# EAGLE schematic lcd_brd (EAGLE 6.2)
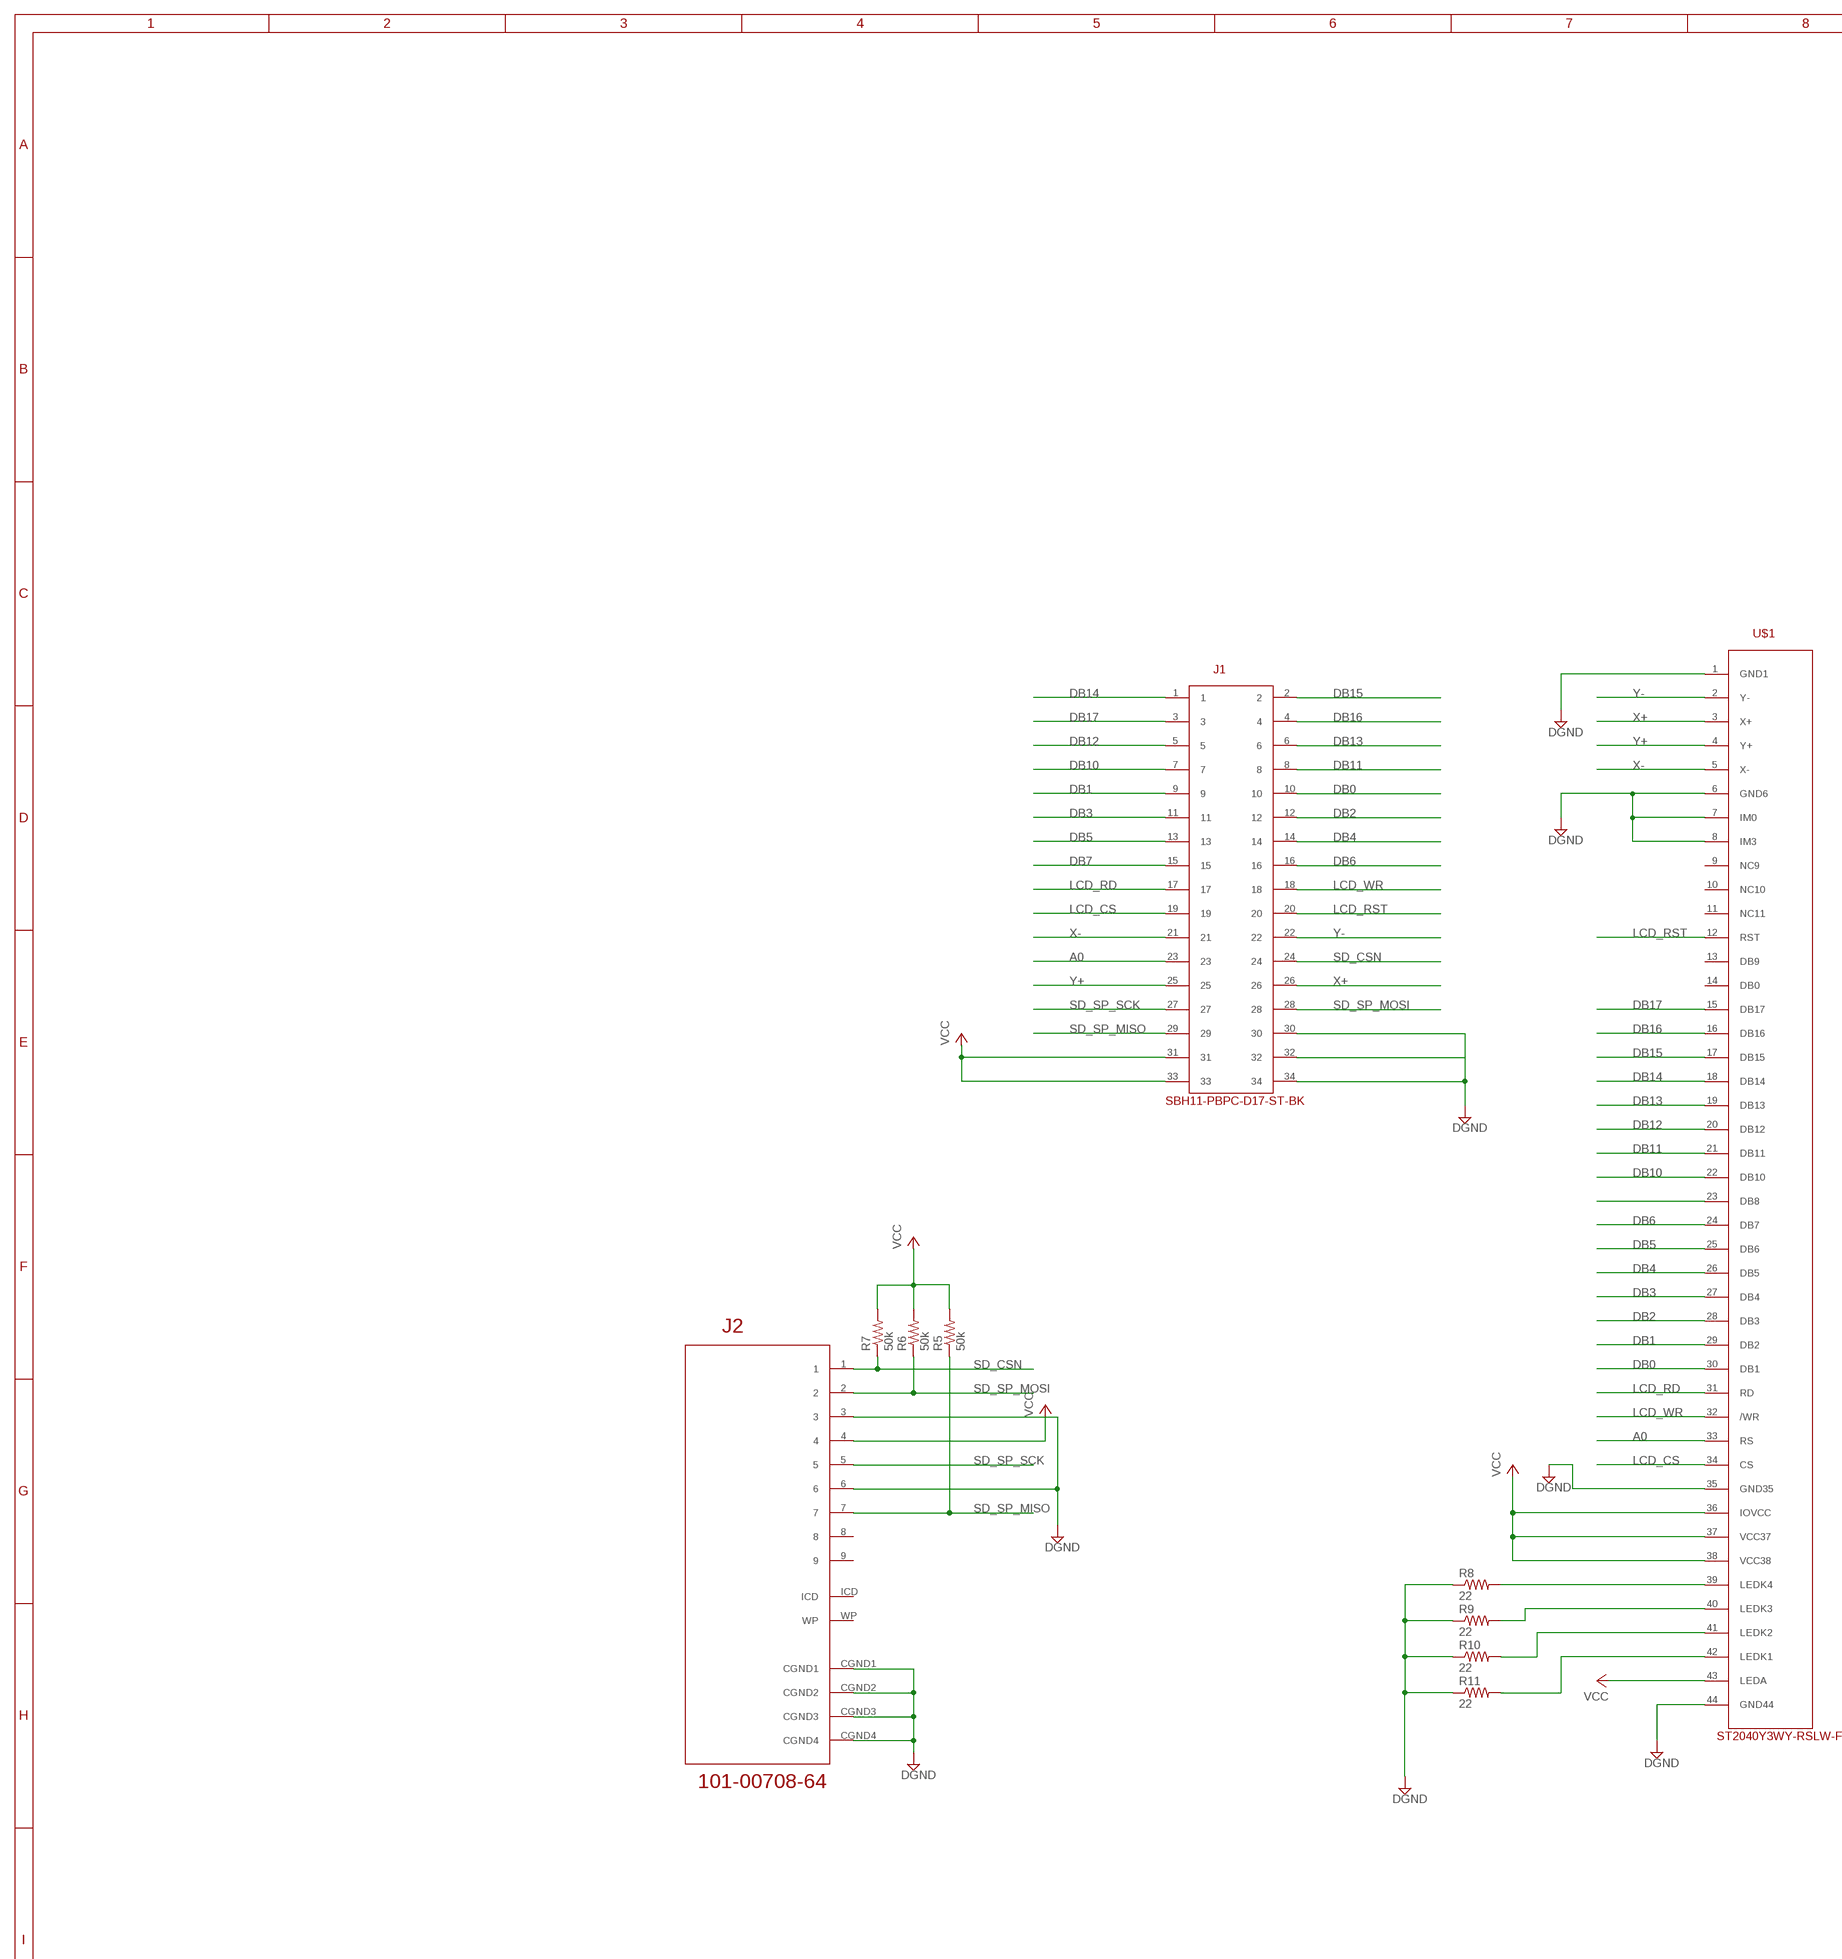
[diagram p0: schematic, sheet 1, part 1 of 2]
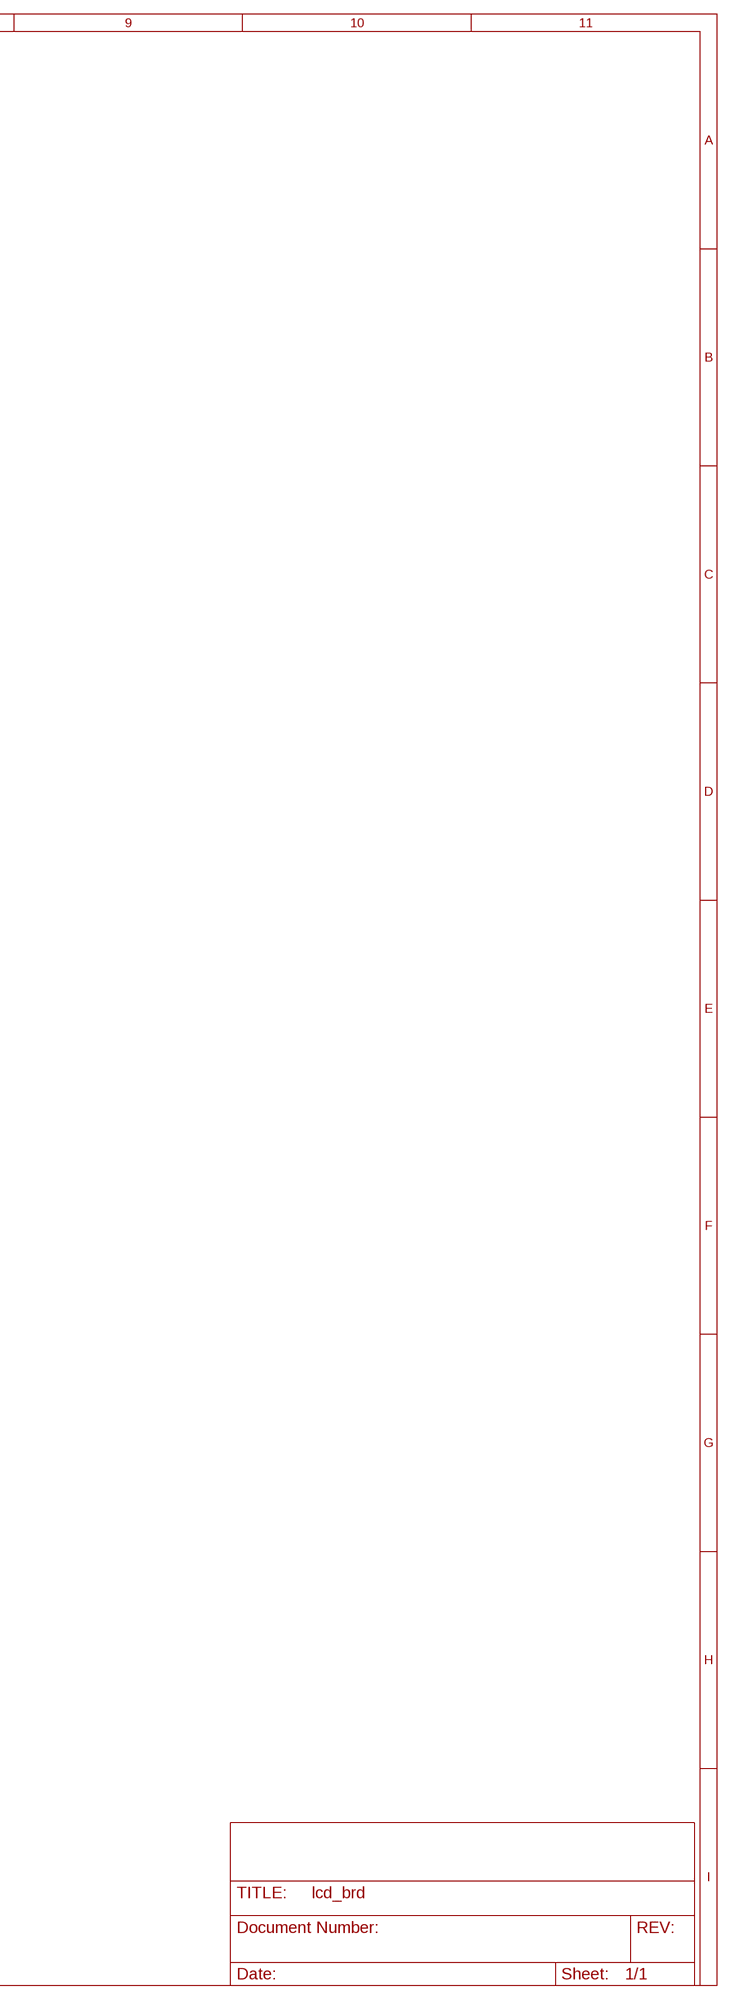
[diagram p1: schematic, sheet 1, part 2 of 2]

## Parts
J1  SBH11-PBPC-D17-ST-BK  [SBH11-PBPC-D17-ST-BK]
J2  101-00708-64  [101-00708-64]
R5  50k  R-US_R0603  [R0603]
R6  50k  R-US_R0603  [R0603]
R7  50k  R-US_R0603  [R0603]
R8  22  R-US_R0603  [R0603]
R9  22  R-US_R0603  [R0603]
R10  22  R-US_R0603  [R0603]
R11  22  R-US_R0603  [R0603]
U$1  ST2040Y3WY-RSLW-F  [ST0240Y3WY-RSLW-F]

## Nets
A0: J1.23 U$1.33(RS)
DB0: J1.10 U$1.30(DB1)
DB1: J1.9 U$1.29(DB2)
DB2: J1.12 U$1.28(DB3)
DB3: J1.11 U$1.27(DB4)
DB4: J1.14 U$1.26(DB5)
DB5: J1.13 U$1.25(DB6)
DB6: J1.16 U$1.24(DB7)
DB7: J1.15 U$1.23(DB8)
DB10: J1.7 U$1.22(DB10)
DB11: J1.8 U$1.21(DB11)
DB12: J1.5 U$1.20(DB12)
DB13: J1.6 U$1.19(DB13)
DB14: J1.1 U$1.18(DB14)
DB15: J1.2 U$1.17(DB15)
DB16: J1.4 U$1.16(DB16)
DB17: J1.3 U$1.15(DB17)
DGND: J1.30 J1.32 J1.34 J2.3 J2.6 J2.CGND1 J2.CGND2 J2.CGND3 J2.CGND4 R8.1 R9.1 R10.1 R11.1 U$1.1(GND1) U$1.6(GND6) U$1.7(IM0) U$1.8(IM3) U$1.35(GND35) U$1.44(GND44)
LCD_CS: J1.19 U$1.34(CS)
LCD_RD: J1.17 U$1.31(RD)
LCD_RST: J1.20 U$1.12(RST)
LCD_WR: J1.18 U$1.32(/WR)
N$12: R8.2 U$1.39(LEDK4)
N$13: R9.2 U$1.40(LEDK3)
N$14: R10.2 U$1.41(LEDK2)
N$15: R11.2 U$1.42(LEDK1)
SD_CSN: J1.24 J2.1 R7.1
SD_SP_MISO: J1.29 J2.7 R5.1
SD_SP_MOSI: J1.28 J2.2 R6.1
SD_SP_SCK: J1.27 J2.5
VCC: J1.31 J1.33 J2.4 R5.2 R6.2 R7.2 U$1.36(IOVCC) U$1.37(VCC37) U$1.38(VCC38) U$1.43(LEDA)
X+: J1.26 U$1.3(X+)
X-: J1.21 U$1.5(X-)
Y+: J1.25 U$1.4(Y+)
Y-: J1.22 U$1.2(Y-)
Unconnected: J2.8 J2.9 J2.ICD J2.WP U$1.9(NC9) U$1.10(NC10) U$1.11(NC11) U$1.13(DB9) U$1.14(DB0)

## Library data of the parts
J1 = SBH11-PBPC-D17-ST-BK:SBH11-PBPC-D17-ST-BK
J2 = 101-00708-64:101-00708-64
R5-R11 = resistor:R-US_: RESISTOR, American symbol
U$1 = ST2040Y3WY-RSLW-F:ST2040Y3WY-RSLW-F